# EAGLE schematic FlashLight_Schematic (EAGLE 9.7.0)
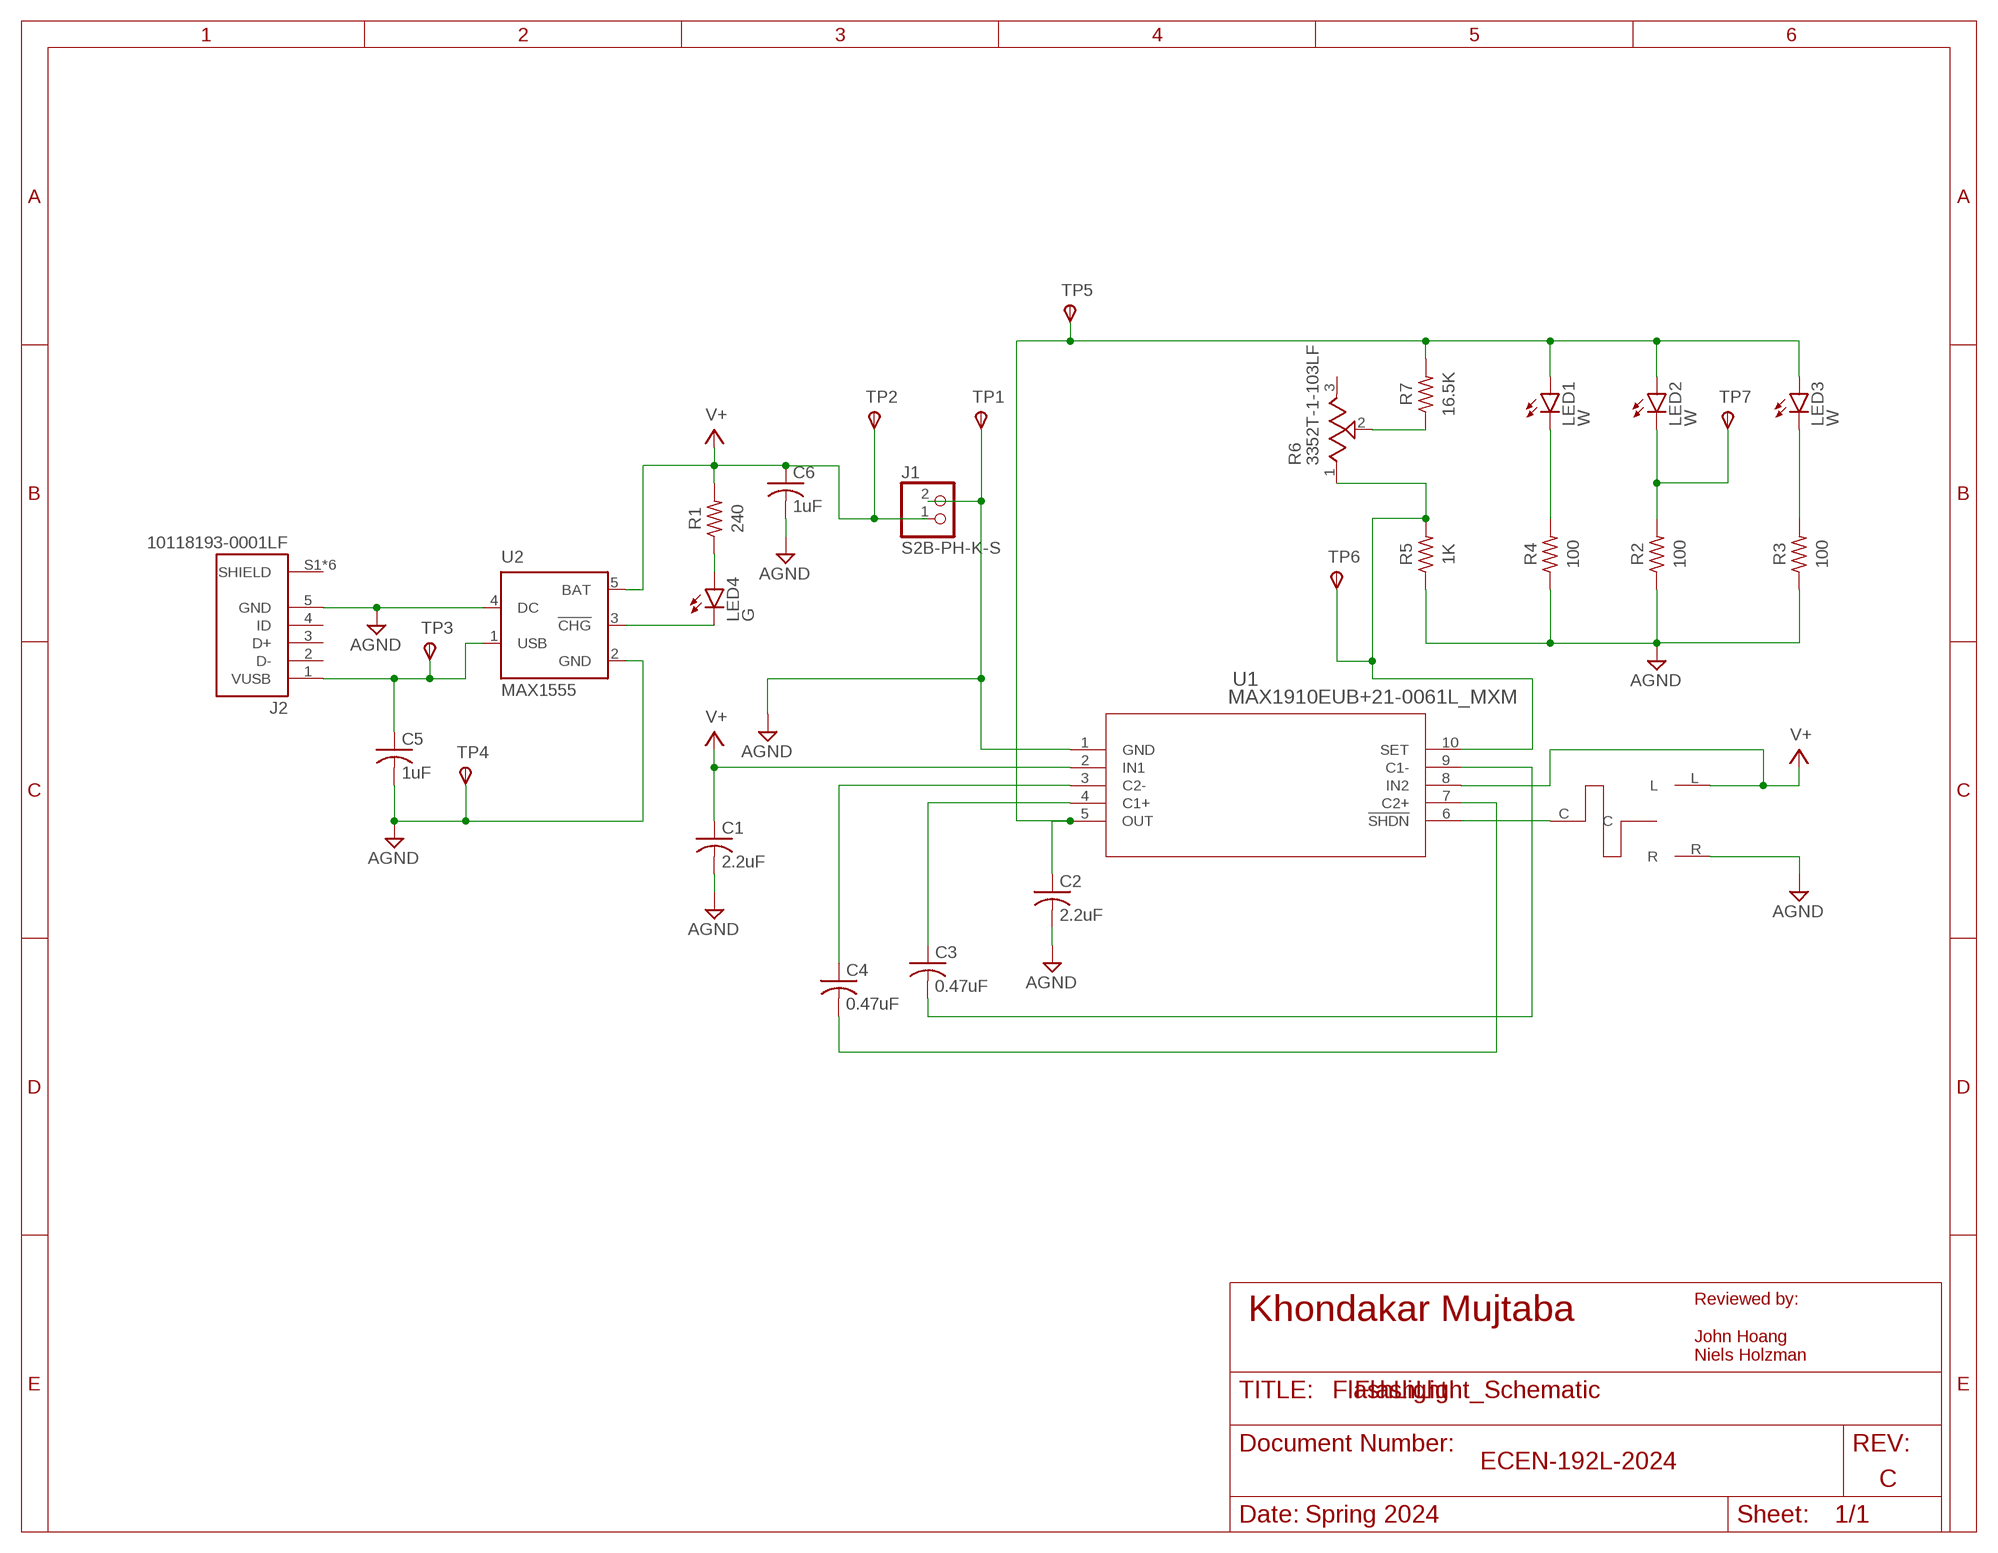
[diagram p0: schematic, sheet 1]

## Parts
C1  2.2uF  C-USC0805  [C0805]
C2  2.2uF  C-USC0805  [C0805]
C3  0.47uF  C-USC0805  [C0805]
C4  0.47uF  C-USC0805  [C0805]
C5  1uF  C-USC0805  [C0805]
C6  1uF  C-USC0805  [C0805]
J1  S2B-PH-K-S  JST_2PIN-THM-RA  [JST-PH-2-THM-RA]
J2  10118193-0001LF  [AMPHENOL_10118193-0001LF]
LED1  W  LED5MM  [LED5MM]
LED2  W  LED5MM  [LED5MM]
LED3  W  LED5MM  [LED5MM]
LED4  G  LEDCHIP-LED0805  [CHIP-LED0805]
R1  240  R-US_CHIP-0805(2012-METRIC)  [RESC2012X65]
R2  100  R-US_CHIP-0805(2012-METRIC)  [RESC2012X65]
R3  100  R-US_CHIP-0805(2012-METRIC)  [RESC2012X65]
R4  100  R-US_CHIP-0805(2012-METRIC)  [RESC2012X65]
R5  1K  R-US_CHIP-0805(2012-METRIC)  [RESC2012X65]
R6  3352T-1-103LF  [TRIM_3352T-1-103LF]
R7  16.5K  R-US_CHIP-0805(2012-METRIC)  [RESC2012X65]
SW1  MY_SWITCH  [B3U-3100P(M)]
TP1  TPSTP20SQ  [TP20SQ]
TP2  TPSTP20SQ  [TP20SQ]
TP3  TPSTP20SQ  [TP20SQ]
TP4  TPSTP20SQ  [TP20SQ]
TP5  TPSTP20SQ  [TP20SQ]
TP6  TPSTP20SQ  [TP20SQ]
TP7  TPSTP20SQ  [TP20SQ]
U1  MAX1910EUB+21-0061L_MXM  [21-0061L_MXM]
U2  MAX1555  [SOT23-5L]

## Nets
AGND: C1.2 C2.2 C5.2 C6.2 J1.2 J2.5(GND) R2.1 R3.1 R4.1 R5.1 SW1.R TP1.TP(PP) TP4.TP(PP) U1.1(GND) U2.2(GND) U2.4(DC)
N$1: C5.1 J2.1(VUSB) TP3.TP(PP) U2.1(USB)
N$2: LED4.A R1.1
N$3: C2.1 LED1.A LED2.A LED3.A R7.2 TP5.TP(PP) U1.5(OUT)
N$4: LED4.C U2.3(!CHG)
N$5: C4.1 U1.3(C2-)
N$6: C4.2 U1.7(C2+)
N$7: C3.1 U1.4(C1+)
N$8: C3.2 U1.9(C1-)
N$9: R5.2 R6.1(CCW) TP6.TP(PP) U1.10(SET)
N$10: R6.2(WIPER) R7.1
N$11: LED1.K(C) R4.2
N$12: LED2.K(C) R2.2 TP7.TP(PP)
N$13: LED3.K(C) R3.2
N$14: SW1.C U1.6(!SHDN)
V+: C1.1 C6.1 J1.1 R1.2 SW1.L TP2.TP(PP) U1.2(IN1) U1.8(IN2) U2.5(BAT)
Unconnected: J2.2(D-) J2.3(D+) J2.4(ID) J2.S1(SHIELD) J2.S2(SHIELD) J2.S3(SHIELD) J2.S4(SHIELD) J2.S5(SHIELD) J2.S6(SHIELD) R6.3(CW)

## Notes on the sheet
- Khondakar Mujtaba
- Reviewed by:
  
  John Hoang
  Niels Holzman
- FlashLight
- ECEN-192L-2024
- C
- Spring 2024

## Library data of the parts
C1-C6 = rcl:C-US: CAPACITOR, American symbol; SPICEPREFIX: C
J1 = adafruit:JST_2PIN: JST 2-Pin Connectors of various flavors SMT-RA (S2B-PH-SM4) 4UConnector #17311 SMT (B2B-PH-SM4) THM-RA (S2B-PH) THM (B2B-PH)
J2 = 10118193-0001LF:10118193-0001LF; MANUFACTURER: Amphenol FCI; MAXIMUM_PACKAGE_HEIGHT: 2.55 mm; PARTREV: E; STANDARD: Manufacturer Recommendations
LED1-LED4 = led:LED: LED OSRAM: - CHIPLED LG R971, LG N971, LY N971, LG Q971, LY Q971, LO R971, LY R971 LH N974, LH R974 LS Q976, LO Q976, LY Q976 LO Q996 - Hyper CHIPLED LW Q18S LB Q993, LB Q99A, LB R99A - SideLED LS A670, LO A670, LY A670, LG A670, LP A670 LB A673, LV A673, LT A673, LW A673 LH A674 LY A675 LS A676, LA A676, LO A676, LY A676, LW A676 LS A679, LY A679, LG A679 - Hyper Micro SIDELED® LS Y876, LA Y876, LO Y876, LY Y876 LT Y87S - SmartLED LW L88C, LW L88S LB L89C, LB L89S, LG L890 LS L89K, LO L89K, LY L89K LS L896, LA L896, LO L896, LY L896 - TOPLED LS T670, LO T670, LY T670, LG T670, LP T670 LSG T670, LSP T670, LSY T670, LOP T670, LYG T670 LG T671, LOG T671, LSG T671 LB T673, LV T673, LT T673, LW T673 LH T674 LS T676, LA T676, LO T676, LY T676, LB T676, LH T676, LSB T676, LW T676 LB T67C, LV T67C, LT T67C, LS T67K, LO T67K, LY T67K, LW E67C LS E67B, LA E67B, LO E67B, LY E67B, LB E67C, LV E67C, LT E67C LW T67C LS T679, LY T679, LG T679 LS T770, LO T770, LY T770, LG T770, LP T770 LB T773, LV T773, LT T773, LW T773 LH T774 LS E675, LA E675, LY E675, LS T675 LS T776, LA T776, LO T776, LY T776, LB T776 LHGB T686 LT T68C, LB T68C - Hyper Mini TOPLED® LB M676 - Mini TOPLED Santana® LG M470 LS M47K, LO M47K, LY M47K Source: http://www.osram.convergy.de LUXEON: - LUMILED® LXK2-PW12-R00, LXK2-PW12-S00, LXK2-PW14-U00, LXK2-PW14-V00 LXK2-PM12-R00, LXK2-PM12-S00, LXK2-PM14-U00 LXK2-PE12-Q00, LXK2-PE12-R00, LXK2-PE12-S00, LXK2-PE14-T00, LXK2-PE14-U00 LXK2-PB12-K00, LXK2-PB12-L00, LXK2-PB12-M00, LXK2-PB14-N00, LXK2-PB14-P00, LXK2-PB14-Q00 LXK2-PR12-L00, LXK2-PR12-M00, LXK2-PR14-Q00, LXK2-PR14-R00 LXK2-PD12-Q00, LXK2-PD12-R00, LXK2-PD12-S00 LXK2-PH12-R00, LXK2-PH12-S00 LXK2-PL12-P00, LXK2-PL12-Q00, LXK2-PL12-R00 Source: www.luxeon.com KINGBRIGHT: KA-3528ASYC Source: www.kingbright.com
R1-R5 R7 = Resistor:R-US: Resistor Fixed - ANSI; CATEGORY: Resistor; SUB-CATEGORY: Fixed
R6 = 3352T-1-103LF:3352T-1-103LF; MANUFACTURER: Bourns; MAXIMUM_PACKAGE_HEIGHT: 4.32mm; PARTREV: 08/19; STANDARD: IPC 2221B
SW1 = My_Switch:MY_SWITCH
TP1-TP7 = testpad:TPS: TEST PIN
U1 = 2024-04-21_23-09-06_Library:MAX1910EUB+; COPYRIGHT: Copyright (C) 2024 Ultra Librarian. All rights reserved.; MANUFACTURER_PART_NUMBER: MAX1910EUB+; MFR_NAME: Analog Devices Inc
U2 = maxim:MAX1555: Dual-Input USB/AC Adapter 1-Cell Li+ Battery Chargers Source: http://www.maxim-ic.com .. MAX1551-MAX1555.pdf; MF: MAXIM; MPN: MAX1555EZK+T; OC_FARNELL: 1628222; OC_NEWARK: 59J2761